# EAGLE design WATCH_LOW_TECH (EAGLE 9.5.2)
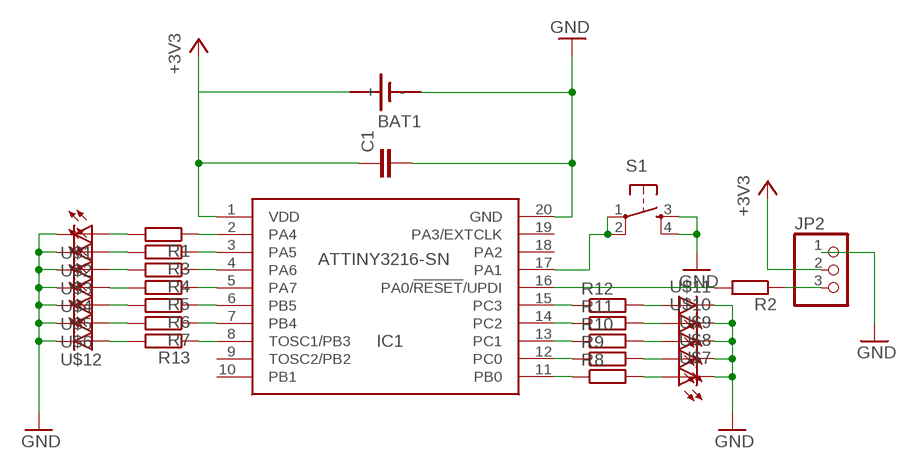
[diagram p0: schematic, sheet 1]

## Parts
BAT1  SN2032  [SN2032]
C1  C-EUC1206  [C1206]
IC1  ATTINY3216-SN  [SOIC127P1030X265-20N]
JP2  PINHD-1X03_2.54  [1X03]
R1  R-EU_R1206  [R1206]
R2  R-EU_R1206  [R1206]
R3  R-EU_R1206  [R1206]
R4  R-EU_R1206  [R1206]
R5  R-EU_R1206  [R1206]
R6  R-EU_R1206  [R1206]
R7  R-EU_R1206  [R1206]
R8  R-EU_R1206  [R1206]
R9  R-EU_R1206  [R1206]
R10  R-EU_R1206  [R1206]
R11  R-EU_R1206  [R1206]
R12  R-EU_R1206  [R1206]
R13  R-EU_R1206  [R1206]
S1  6MM_SWITCH6MM_SWITCH  [6MM_SWITCH]
U$1  LEDFAB1206  [LED1206FAB]
U$2  LEDFAB1206  [LED1206FAB]
U$3  LEDFAB1206  [LED1206FAB]
U$4  LEDFAB1206  [LED1206FAB]
U$5  LEDFAB1206  [LED1206FAB]
U$6  LEDFAB1206  [LED1206FAB]
U$7  LEDFAB1206  [LED1206FAB]
U$8  LEDFAB1206  [LED1206FAB]
U$9  LEDFAB1206  [LED1206FAB]
U$10  LEDFAB1206  [LED1206FAB]
U$11  LEDFAB1206  [LED1206FAB]
U$12  LEDFAB1206  [LED1206FAB]

## Nets
+3V3: BAT1.+ C1.1 IC1.1(VDD) JP2.2
GND: BAT1.- C1.2 IC1.20(GND) JP2.1 S1.3(S) S1.4(S1) U$1.2(C) U$2.2(C) U$3.2(C) U$4.2(C) U$5.2(C) U$6.2(C) U$7.2(C) U$8.2(C) U$9.2(C) U$10.2(C) U$11.2(C) U$12.2(C)
N$1: R1.2 U$1.1(A)
N$2: IC1.2(PA4) R1.1
N$3: IC1.16(PA0/!RESET!/UPDI) R2.2
N$4: JP2.3 R2.1
N$5: IC1.11(PB0) R8.1
N$6: IC1.12(PC0) R9.1
N$7: IC1.13(PC1) R10.1
N$8: IC1.14(PC2) R11.1
N$9: IC1.15(PC3) R12.1
N$10: IC1.8(TOSC1/PB3) R13.1
N$11: IC1.7(PB4) R7.1
N$12: IC1.6(PB5) R6.1
N$13: IC1.5(PA7) R5.1
N$14: IC1.4(PA6) R4.1
N$15: IC1.3(PA5) R3.1
N$16: R3.2 U$2.1(A)
N$17: R4.2 U$3.1(A)
N$18: R5.2 U$4.1(A)
N$19: R6.2 U$5.1(A)
N$20: R7.2 U$6.1(A)
N$21: R13.2 U$12.1(A)
N$22: R12.2 U$11.1(A)
N$23: R11.2 U$10.1(A)
N$24: R10.2 U$9.1(A)
N$25: R9.2 U$8.1(A)
N$26: R8.2 U$7.1(A)
N$27: IC1.17(PA1) S1.1(P) S1.2(P1)
Unconnected: IC1.9(TOSC2/PB2) IC1.10(PB1) IC1.18(PA2) IC1.19(PA3/EXTCLK)

## Library data of the parts
BAT1 = sn2032:SN2032: LI BATTERY
C1 = rcl:C-EU: CAPACITOR, European symbol; SPICEPREFIX: C
IC1 = OPENBOT:ATTINY3216-SN: MICROCHIP - ATTINY3216-SN - 8 Bit MCU, AVR Family ATtiny3216 Series Microcontrollers, 20 MHz, 32 KB, 2 KB, 20 Pins, SOIC Source: Datasheet <https://componentsearchengine.com/Datasheets/1/ATTINY3216-SN.pdf>; AVAILABILITY: Unavailable; DESCRIPTION: AVR tinyAVR™ 1 Microcontroller IC 8-Bit 20MHz 32KB (32K x 8) FLASH 20-SOIC; DIGIKEY-PURCHASE-URL: https://snapeda.com/shop?store=DigiKey&id=4652473; MF: Microchip Technology; MOUSER-PURCHASE-URL: https://snapeda.com/shop?store=Mouser&id=4652473; MP: ATTINY3216-SN; PACKAGE: SOIC-20 Microchip Technology; PRICE: None
JP2 = pinhead-2:PINHD-1X03: PIN HEADER
R1-R13 = rcl:R-EU_: RESISTOR, European symbol; SPICEPREFIX: R
S1 = fab:6MM_SWITCH: OMRON SWITCH
U$1-U$12 = fab:LED: LED

## Board
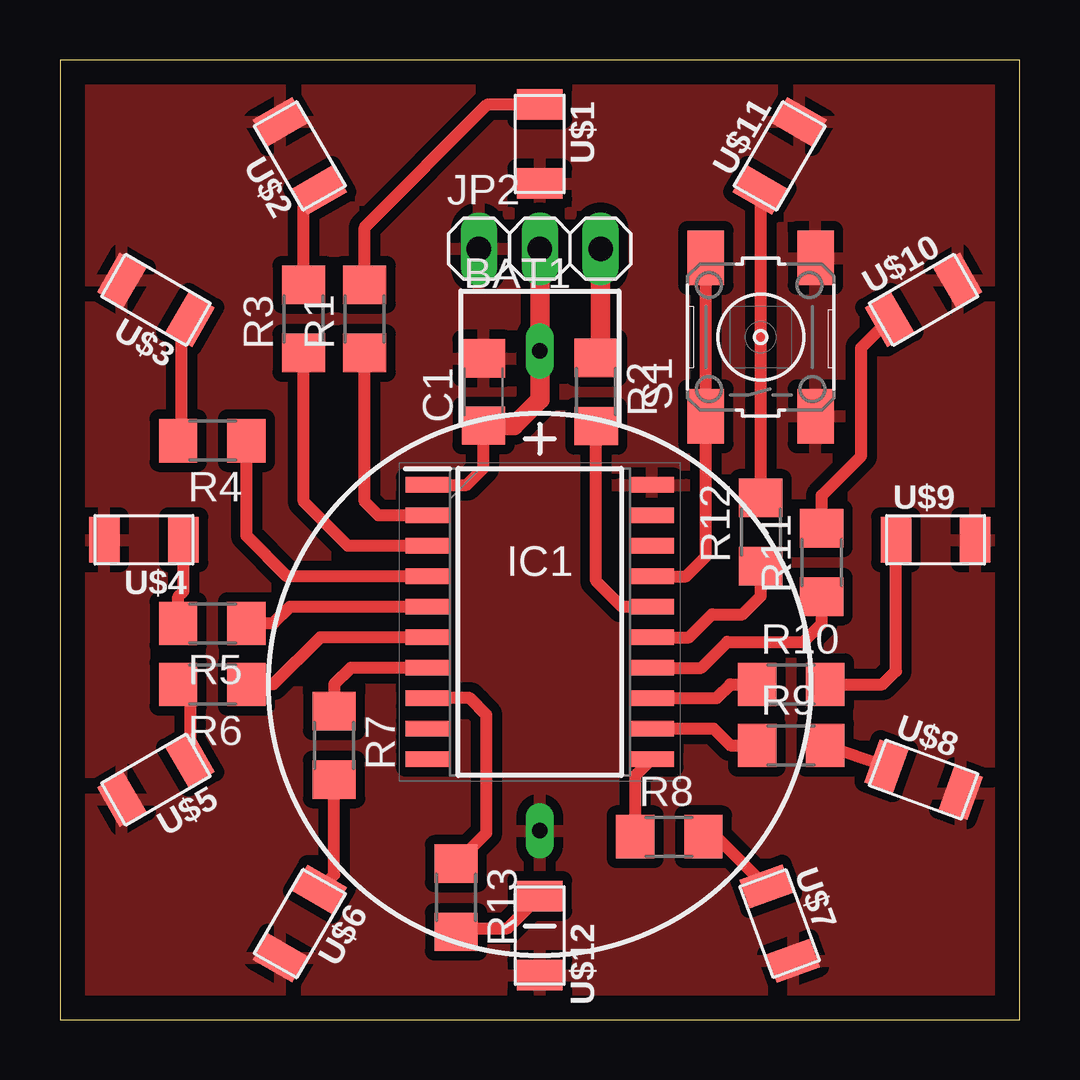
[diagram p1: board, top side]

Size 40 x 40 mm. Coordinates in mm from the lower left corner, seen from the top.
Outline: 0,0 40,0 40,40 0,40 0,0
Copper layers (1*16): Top 0.035mm / dielectric 1.5mm / Bottom 0.035mm
Design rules "default *": minimum track width 6mil, minimum drill 0.35mm, track to track 0.4mm, track to pad 0.4mm, pad to pad 0.4mm, via to via 0.4mm, smd to smd 0.4mm, copper to edge 40mil, drill to drill 6mil, minimum pad ring 10mil, minimum via ring 8mil, stop-mask expansion 4mil, vias tented up to drill 0mil, thermal gap 0.4mm

### Footprints (pad centres in the part's own frame; a part is rotated, then mirrored left to right if it is on the bottom)
SN2032 = drill 0.65 long: + 0,13.9; - 0,-6.1
C1206 = smd 1.6 x 1.8: 1 -1.4,0; 2 1.4,0
SOIC127P1030X265-20N = smd 1.85 x 0.65: 1 -4.675,5.715; 2 -4.675,4.445; 3 -4.675,3.175; 4 -4.675,1.905; 5 -4.675,0.635; 6 -4.675,-0.635; 7 -4.675,-1.905; 8 -4.675,-3.175; 9 -4.675,-4.445; 10 -4.675,-5.715; 11 4.675,-5.715; 12 4.675,-4.445; 13 4.675,-3.175; 14 4.675,-1.905; 15 4.675,-0.635; 16 4.675,0.635; 17 4.675,1.905; 18 4.675,3.175; 19 4.675,4.445; 20 4.675,5.715
1X03 = drill 1.016 long: 1 -2.54,0; 2 0,0; 3 2.54,0
R1206 = smd 1.6 x 1.803: 1 -1.422,0; 2 1.422,0
6MM_SWITCH = smd 2.286 x 1.524: 1 -3.302,2.286; 2 3.302,2.286; 3 -3.302,-2.286; 4 3.302,-2.286
LED1206FAB = smd 1.27 x 1.905: 1 -1.651,0; 2 1.651,0

### Placement (x,y rotation side)
BAT1  20,13.97 0 top
C1  17.65,26.16 90 top
IC1  20,16.57 0 top
JP2  20,32.13 0 top
R1  12.7,29.21 90 top
R2  22.35,26.16 270 top
R3  10.16,29.21 90 top
R4  6.35,24.13 180 top
R5  6.35,16.51 180 top
R6  6.35,13.97 180 top
R7  11.43,11.43 270 top
R8  25.4,7.62 0 top
R9  30.48,11.43 0 top
R10  30.48,13.97 0 top
R11  31.75,19.05 90 top
R12  29.21,20.32 90 top
R13  16.51,5.08 270 top
S1  29.21,28.45 90 top
U$1  20,36.5 270 top
U$2  10,36 120 top
U$3  4,30 150 top
U$4  3.5,20 180 top
U$5  4,10 210 top
U$6  10,4 240 top
U$7  30,4 290 top
U$8  36,10 340 top
U$9  36.5,20 0 top
U$10  36,30 30 top
U$11  30,36 60 top
U$12  20,3.5 270 top

### Tracks (layer width: path | path; a pad name or v marks a point on that pad's centre or on a via)
+3V3
  Top 0.508: IC1.1 16.95,22.29 17.65,22.99 C1.1
  Top 0.813: C1.1 18.92,24.76 20,25.84 BAT1.+ JP2.2
GND
  pour Top: -1.27,40.64 40.64,40.64 40.64,-1.27 -1.27,-1.27
N$1
  Top 0.508: R1.2 12.7,33.02 17.83,38.15 U$1.1
N$2
  Top 0.508: IC1.2 13.27,21.02 12.7,21.59 R1.1
N$3
  Top 0.508: IC1.16 23.43,17.21 22.35,18.29 R2.2
N$4
  Top 0.813: R2.1 22.54,27.77 JP2.3
N$5
  Top 0.508: IC1.11 23.98,10.16 R8.1
N$6
  Top 0.508: IC1.12 27.24,12.13 27.94,11.43 R9.1
N$7
  Top 0.508: IC1.13 27.37,13.4 27.94,13.97 R10.1
N$8
  Top 0.508: IC1.14 26.73,14.67 27.81,15.75 30.99,15.75 31.75,16.51 R11.1
N$9
  Top 0.508: IC1.15 26.22,15.94 27.18,16.89 28.45,16.89 29.21,17.65 R12.1
N$10
  Top 0.508: R13.1 17.78,7.77 17.78,12.7 17.08,13.4 IC1.8
N$11
  Top 0.508: IC1.7 12.13,14.67 11.43,13.97 R7.1
N$12
  Top 0.508: IC1.6 10.86,15.94 8.89,13.97 R6.1
N$13
  Top 0.508: IC1.5 9.59,17.21 8.89,16.51 R5.1
N$14
  Top 0.508: IC1.4 9.46,18.48 7.77,20.17 R4.1
N$15
  Top 0.508: IC1.3 12,19.75 10.16,21.59 R3.1
N$16
  Top 0.508: R3.2 10.16,33.91 U$2.1
N$17
  Top 0.508: R4.2 5.08,24.28 5.08,28.82 U$3.1
N$18
  Top 0.508: R5.2 4.93,17.63 5.15,17.85 U$4.1
N$19
  Top 0.508: R6.2 5.43,13.47 U$5.1
N$20
  Top 0.508: U$6.1 11.43,6.03 R7.2
N$21
  Top 0.508: R13.2 16.66,3.81 18.66,3.81 U$12.1
N$22
  Top 0.508: R12.2 29.21,34.53 U$11.1
N$23
  Top 0.508: R11.2 31.75,21.84 33.4,23.5 33.4,28 U$10.1
N$24
  Top 0.508: R10.2 34.29,13.97 34.85,14.53 U$9.1
N$25
  Top 0.508: R9.2 U$8.1
N$26
  Top 0.508: R8.2 27.37,7.62 U$7.1
N$27
  Top 0.508: IC1.17 26.1,18.48 26.92,19.3 S1.1 S1.2